# EAGLE design en76-vco4 (EAGLE 6.6.0)
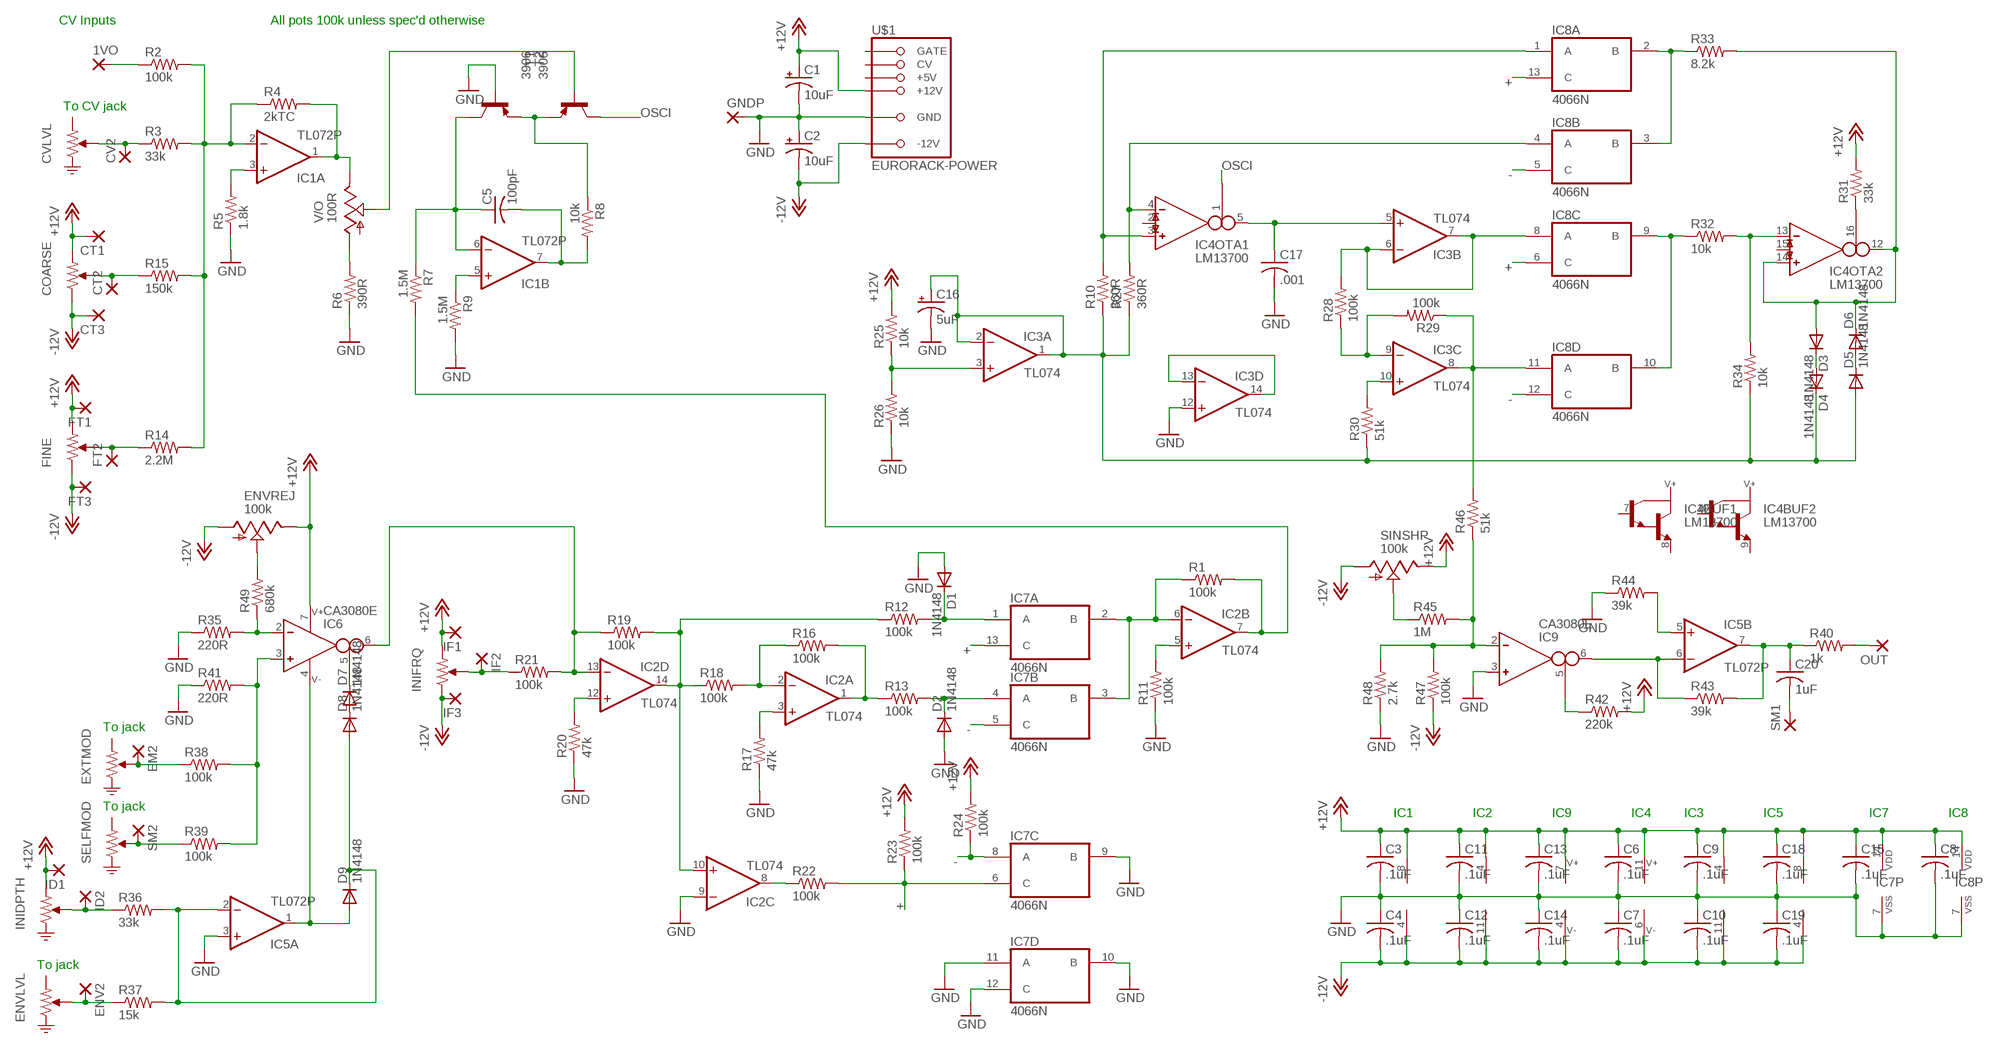
[diagram p0: schematic, sheet 1]

## Parts
1VO  2,54/1,0  [2,54/1,0]
C1  10uF  CPOL-USE2-5  [E2-5]
C2  10uF  CPOL-USE2-5  [E2-5]
C3  .1uF  C-US050-025X075  [C050-025X075]
C4  .1uF  C-US050-025X075  [C050-025X075]
C5  100pF  C-US050-025X075  [C050-025X075]
C6  .1uF  C-US050-025X075  [C050-025X075]
C7  .1uF  C-US050-025X075  [C050-025X075]
C8  .1uF  C-US050-025X075  [C050-025X075]
C9  .1uF  C-US050-025X075  [C050-025X075]
C10  .1uF  C-US050-025X075  [C050-025X075]
C11  .1uF  C-US050-025X075  [C050-025X075]
C12  .1uF  C-US050-025X075  [C050-025X075]
C13  .1uF  C-US050-025X075  [C050-025X075]
C14  .1uF  C-US050-025X075  [C050-025X075]
C15  .1uF  C-US050-025X075  [C050-025X075]
C16  5uF  CPOL-USE2-5  [E2-5]
C17  .001  C-US050-025X075  [C050-025X075]
C18  .1uF  C-US050-025X075  [C050-025X075]
C19  .1uF  C-US050-025X075  [C050-025X075]
C20  1uF  C-US050-025X075  [C050-025X075]
COARSE  POT  (no package)
CT1  2,54/1,0  [2,54/1,0]
CT2  2,54/1,0  [2,54/1,0]
CT3  2,54/1,0  [2,54/1,0]
CV2  2,54/1,0  [2,54/1,0]
CVLVL  POT-ATTEN  (no package)
D1  1N4148  1N4148DO35-7  [DO35-7]
D2  1N4148  1N4148DO35-7  [DO35-7]
D3  1N4148  1N4148DO35-7  [DO35-7]
D4  1N4148  1N4148DO35-7  [DO35-7]
D5  1N4148  1N4148DO35-7  [DO35-7]
D6  1N4148  1N4148DO35-7  [DO35-7]
D7  1N4148  1N4148DO35-7  [DO35-7]
D8  1N4148  1N4148DO35-7  [DO35-7]
D9  1N4148  1N4148DO35-7  [DO35-7]
EM2  2,54/1,0  [2,54/1,0]
ENV2  2,54/1,0  [2,54/1,0]
ENVLVL  POT-ATTEN  (no package)
ENVREJ  100k  TRIM_US-RJ9W  [RJ9W]
EXTMOD  POT-ATTEN  (no package)
FINE  POT  (no package)
FT1  2,54/1,0  [2,54/1,0]
FT2  2,54/1,0  [2,54/1,0]
FT3  2,54/1,0  [2,54/1,0]
GNDP  2,54/1,0  [2,54/1,0]
IC1  TL072P  [DIL08]
IC2  TL074  TL074-TOPP  [DIL14]
IC3  TL074  TL074-TOPP  [DIL14]
IC4  LM13700  LM13700-TOPDIP16  [DIL16]
IC5  TL072P  [DIL08]
IC6  CA3080E  [DIL08]
IC7  4066N  [DIL14]
IC8  4066N  [DIL14]
IC9  CA3080E  [DIL08]
ID1  2,54/1,0  [2,54/1,0]
ID2  2,54/1,0  [2,54/1,0]
IF1  2,54/1,0  [2,54/1,0]
IF2  2,54/1,0  [2,54/1,0]
IF3  2,54/1,0  [2,54/1,0]
INIDPTH  POT-ATTEN  (no package)
INIFRQ  POT  (no package)
OUT  2,54/1,0  [2,54/1,0]
R1  100k  R-US_0207/10  [0207/10]
R2  100k  R-US_0207/10  [0207/10]
R3  33k  R-US_0207/10  [0207/10]
R4  2kTC  R-US_0207/10  [0207/10]
R5  1.8k  R-US_0207/10  [0207/10]
R6  390R  R-US_0207/10  [0207/10]
R7  1.5M  R-US_0207/10  [0207/10]
R8  10k  R-US_0207/10  [0207/10]
R9  1.5M  R-US_0207/10  [0207/10]
R10  360R  R-US_0207/10  [0207/10]
R11  100k  R-US_0207/10  [0207/10]
R12  100k  R-US_0207/10  [0207/10]
R13  100k  R-US_0207/10  [0207/10]
R14  2.2M  R-US_0207/10  [0207/10]
R15  150k  R-US_0207/10  [0207/10]
R16  100k  R-US_0207/10  [0207/10]
R17  47k  R-US_0207/10  [0207/10]
R18  100k  R-US_0207/10  [0207/10]
R19  100k  R-US_0207/10  [0207/10]
R20  47k  R-US_0207/10  [0207/10]
R21  100k  R-US_0207/10  [0207/10]
R22  100k  R-US_0207/10  [0207/10]
R23  100k  R-US_0207/10  [0207/10]
R24  100k  R-US_0207/10  [0207/10]
R25  10k  R-US_0207/10  [0207/10]
R26  10k  R-US_0207/10  [0207/10]
R27  360R  R-US_0207/10  [0207/10]
R28  100k  R-US_0207/10  [0207/10]
R29  100k  R-US_0207/10  [0207/10]
R30  51k  R-US_0207/10  [0207/10]
R31  33k  R-US_0207/10  [0207/10]
R32  10k  R-US_0207/10  [0207/10]
R33  8.2k  R-US_0207/10  [0207/10]
R34  10k  R-US_0207/10  [0207/10]
R35  220R  R-US_0207/10  [0207/10]
R36  33k  R-US_0207/10  [0207/10]
R37  15k  R-US_0207/10  [0207/10]
R38  100k  R-US_0207/10  [0207/10]
R39  100k  R-US_0207/10  [0207/10]
R40  1k  R-US_0207/10  [0207/10]
R41  220R  R-US_0207/10  [0207/10]
R42  220k  R-US_0207/10  [0207/10]
R43  39k  R-US_0207/10  [0207/10]
R44  39k  R-US_0207/10  [0207/10]
R45  1M  R-US_0207/10  [0207/10]
R46  51k  R-US_0207/10  [0207/10]
R47  100k  R-US_0207/10  [0207/10]
R48  2.7k  R-US_0207/10  [0207/10]
R49  680k  R-US_0207/10  [0207/10]
SELFMOD  POT-ATTEN  (no package)
SINSHP  100k  TRIM_US-RJ9W  [RJ9W]
SM1  2,54/1,0  [2,54/1,0]
SM2  2,54/1,0  [2,54/1,0]
T1  3906  2N3906-PNP-TO92-EBC  [TO92-EBC]
T2  3906  2N3906-PNP-TO92-EBC  [TO92-EBC]
U$1  EURORACK-POWER  [PINSHRD_PTH_2X8]
V/O  100R  TRIM_US-RJ9W  [RJ9W]

## Nets
+: IC7.6(C:C) IC7.13(A:C) IC8.6(C:C) IC8.13(A:C) R22.2 R23.1
+12V: C1.+ C3.1 C6.1 C8.1 C9.1 C11.1 C13.1 C15.1 C18.1 COARSE.1 CT1.1(P) ENVREJ.E FINE.1 FT1.1(P) IC1.8(P:V+) IC2.4(P:V+) IC3.4(P:V+) IC4.11 IC5.8(P:V+) IC6.7 IC7.14(P:VDD) IC8.14(P:VDD) IC9.7 ID1.1(P) IF1.1(P) INIDPTH.1 INIFRQ.1 R23.2 R24.2 R25.2 R31.2 R42.2 SINSHP.E U$1.+12V@1(+12V) U$1.+12V@2(+12V)
-: IC7.5(B:C) IC7.8(C:A) IC8.5(B:C) IC8.12(D:C) R24.1
-12V: C2.- C4.2 C7.2 C10.2 C12.2 C14.2 C19.2 COARSE.3 CT3.1(P) ENVREJ.A FINE.3 FT3.1(P) IC1.4(P:V-) IC2.11(P:V-) IC3.11(P:V-) IC4.6 IC5.4(P:V-) IC9.4 IF3.1(P) INIFRQ.3 R47.1 SINSHP.A U$1.-12V@1(-12V) U$1.-12V@2(-12V)
GND: C1.- C2.+ C3.2 C4.1 C6.2 C7.1 C8.2 C9.2 C10.1 C11.2 C12.1 C13.2 C14.1 C15.2 C16.- C17.2 C18.2 C19.1 D1.A D2.A GNDP.1(P) IC2.9(C:-IN) IC3.12(D:+IN) IC5.3(A:+IN) IC7.7(P:VSS) IC7.9(C:B) IC7.10(D:B) IC7.11(D:A) IC7.12(D:C) IC8.7(P:VSS) IC9.3(IN_P) R5.1 R6.1 R9.2 R11.1 R17.1 R20.1 R26.1 R35.1 R41.1 R44.1 R48.1 T2.B U$1.GND@1(GND) U$1.GND@2(GND) U$1.GND@3(GND) U$1.GND@4(GND) U$1.GND@5(GND) U$1.GND@6(GND)
N$1: COARSE.2 CT2.1(P) R15.1
N$2: CV2.1(P) CVLVL.2 R3.1
N$3: 1VO.1(P) R2.1
N$4: T1.B V/O.S
N$5: IC1.3(A:+IN) R5.2
N$6: IC1.2(A:-IN) R2.2 R3.2 R4.1 R14.2 R15.2
N$7: IC1.1(A:OUT) R4.2 V/O.E
N$8: R6.2 V/O.A
N$9: C5.1 IC1.6(B:-IN) R7.1 T2.C
N$10: R8.1 T1.E T2.E
N$11: C5.2 IC1.7(B:OUT) R8.2
N$12: FINE.2 FT2.1(P) R14.1
N$13: IC4.3(OTA1:IN_P) IC8.1(A:A) R10.2
N$14: IC1.5(B:+IN) R9.1
N$15: IC2.6(B:-IN) IC7.2(A:B) IC7.3(B:B) R1.1
N$16: IC2.5(B:+IN) R11.2
N$17: D1.C IC7.1(A:A) R12.2
N$18: IC2.10(C:+IN) IC2.14(D:OUT) R12.1 R18.1 R19.2
N$19: D2.C IC7.4(B:A) R13.2
N$20: IC2.1(A:OUT) R13.1 R16.2
N$21: IC2.3(A:+IN) R17.2
N$22: ENVREJ.S R49.2
N$23: IC2.13(D:-IN) IC6.6(OUT) R19.1 R21.2
N$24: IC2.12(D:+IN) R20.2
N$25: IC2.2(A:-IN) R16.1 R18.2
N$26: IC3.8(C:OUT) IC8.11(D:A) R29.1 R46.2
N$27: IF2.1(P) INIFRQ.2 R21.1
N$28: IC3.3(A:+IN) R25.1 R26.2
N$29: IC2.8(C:OUT) R22.1
N$30: C16.+ D4.C D5.A IC3.1(A:OUT) IC3.2(A:-IN) R10.1 R27.1 R30.1 R34.1
N$31: IC4.4(OTA1:IN_N) IC8.4(B:A) R27.2
N$32: IC8.9(C:B) IC8.10(D:B) R32.1
N$33: C17.1 IC3.5(B:+IN) IC4.5(OTA1:OUT)
N$34: IC3.6(B:-IN) IC3.7(B:OUT) IC8.8(C:A) R28.2
N$35: IC3.9(C:-IN) R28.1 R29.2
N$36: IC8.2(A:B) IC8.3(B:B) R33.1
N$37: IC3.10(C:+IN) R30.2
N$38: IC4.16(OTA2:I_BIAS) R31.1
N$39: IC4.13(OTA2:IN_N) R32.2 R34.2
N$40: D3.A D6.C IC4.12(OTA2:OUT) IC4.14(OTA2:IN_P) R33.2
N$41: IC6.2(IN_N) R35.2 R49.1
N$42: D3.C D4.A
N$43: D5.C D6.A
N$44: IC3.13(D:-IN) IC3.14(D:OUT)
N$45: D9.A IC5.1(A:OUT) IC6.4
N$46: D7.C IC6.5(I_BIAS)
N$47: D7.A D8.C
N$48: ID2.1(P) INIDPTH.2 R36.1
N$49: D8.A D9.C IC5.2(A:-IN) R36.2 R37.2
N$50: ENV2.1(P) ENVLVL.2 R37.1
N$51: EM2.1(P) EXTMOD.2 R38.1
N$52: R39.1 SELFMOD.2 SM2.1(P)
N$53: C20.1 IC5.7(B:OUT) R40.1 R43.2
N$54: C20.2 SM1.1(P)
N$55: OUT.1(P) R40.2
N$56: IC6.3(IN_P) R38.2 R39.2 R41.2
N$57: IC5.6(B:-IN) IC9.6(OUT) R43.1
N$58: IC9.5(I_BIAS) R42.1
N$59: IC5.5(B:+IN) R44.2
N$60: IC9.2(IN_N) R45.2 R46.1 R47.2 R48.2
N$61: R45.1 SINSHP.S
N$62: IC2.7(B:OUT) R1.2 R7.2
OSCI: IC4.1(OTA1:I_BIAS) T1.C
Unconnected: CVLVL.1 ENVLVL.1 EXTMOD.1 IC4.2(OTA1:I_DIODE) IC4.7(BUF1:B) IC4.8(BUF1:E) IC4.9(BUF2:E) IC4.10(BUF2:B) IC4.15(OTA2:I_DIODE) SELFMOD.1 U$1.+5V@1(+5V) U$1.+5V@2(+5V) U$1.CV@1(CV) U$1.CV@2(CV) U$1.GATE@1(GATE) U$1.GATE@2(GATE)

## Notes on the sheet
- CV Inputs | All pots 100k unless spec'd otherwise
- To CV jack
- To jack
- To jack
- IC1 | IC2 | IC9 | IC4 | IC3 | IC5 | IC7 | IC8
- To jack

## Library data of the parts
1VO CT1-CT3 CV2 EM2 ENV2 FT1-FT3 GNDP ID1 ID2 IF1-IF3 OUT SM1 SM2 = wirepad:2,54/1,0: THROUGH-HOLE PAD
C1 C2 C16 = rcl:CPOL-US: POLARIZED CAPACITOR, American symbol
C3-C15 C17-C20 = rcl:C-US: CAPACITOR, American symbol
COARSE FINE INIFRQ = mmoretti:POT
CVLVL ENVLVL EXTMOD INIDPTH SELFMOD = mmoretti:POT-ATTEN
D1-D9 = diode:1N4148: DIODE high speed (Philips)
ENVREJ SINSHP V/O = pot:TRIM_US-: POTENTIOMETER
IC1 IC5 = mmoretti:TL072: OP AMP
IC2 IC3 = mmoretti:TL074-TOP: OP AMP
IC4 = mmoretti:LM13700-TOP
IC6 IC9 = mmoretti:CA3080: OTA
IC7 IC8 = 40xx:4066: Quad bilateral ANALOG SWITCH
R1-R49 = rcl:R-US_: RESISTOR, American symbol
T1 T2 = transistor-neu-to92:*-PNP-: PNP Transistror
U$1 = mmoretti:EURORACK-POWER

## Board
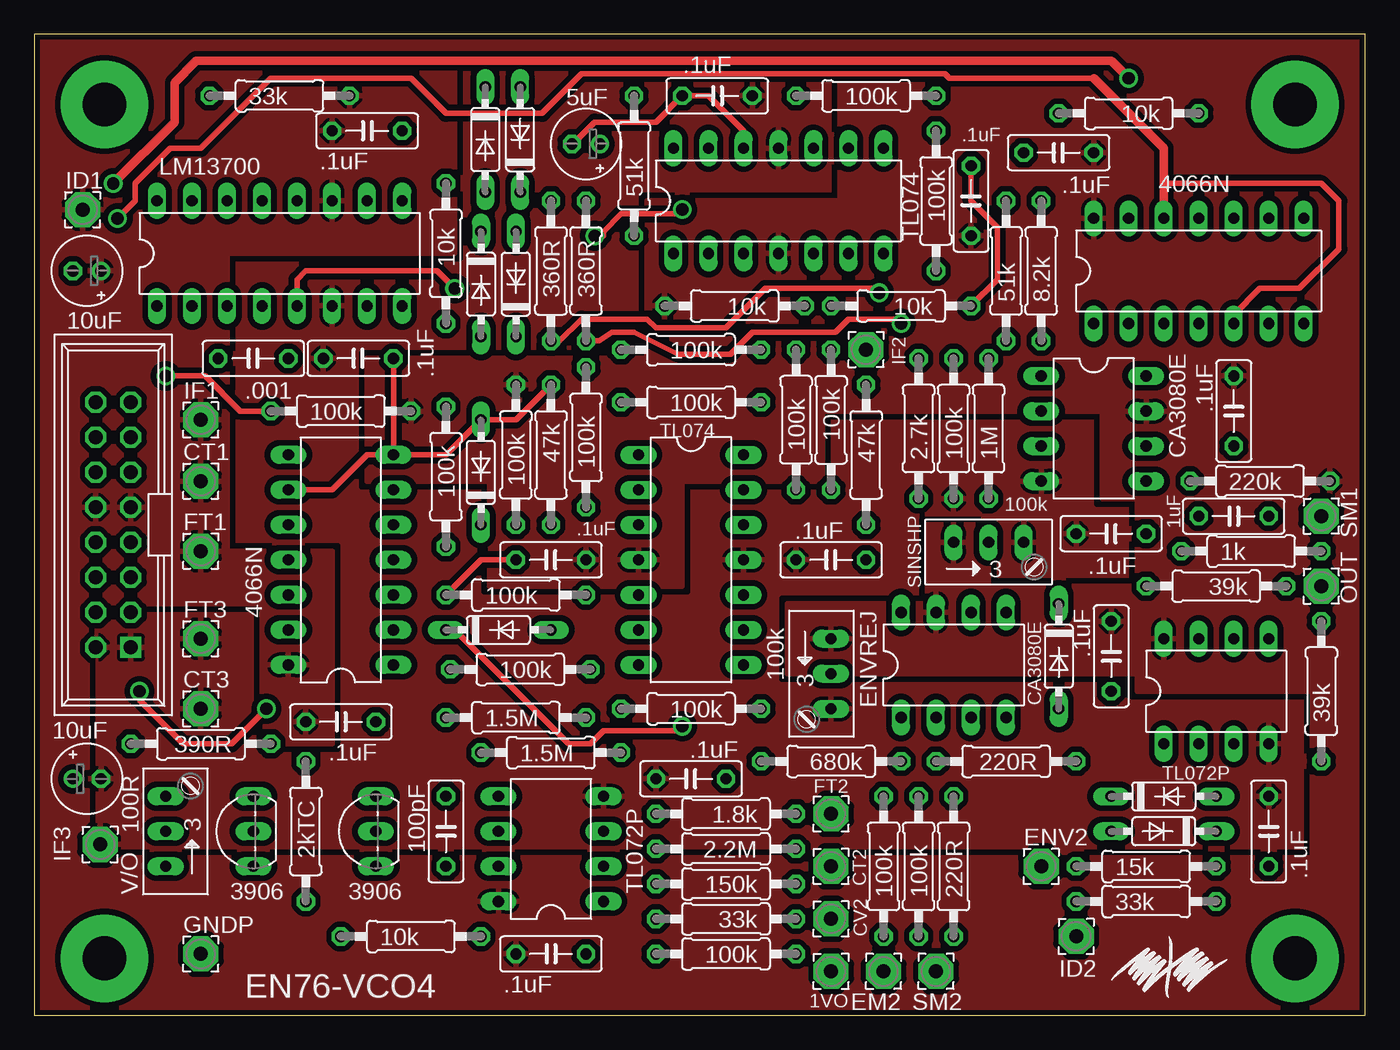
[diagram p1: board, top side]
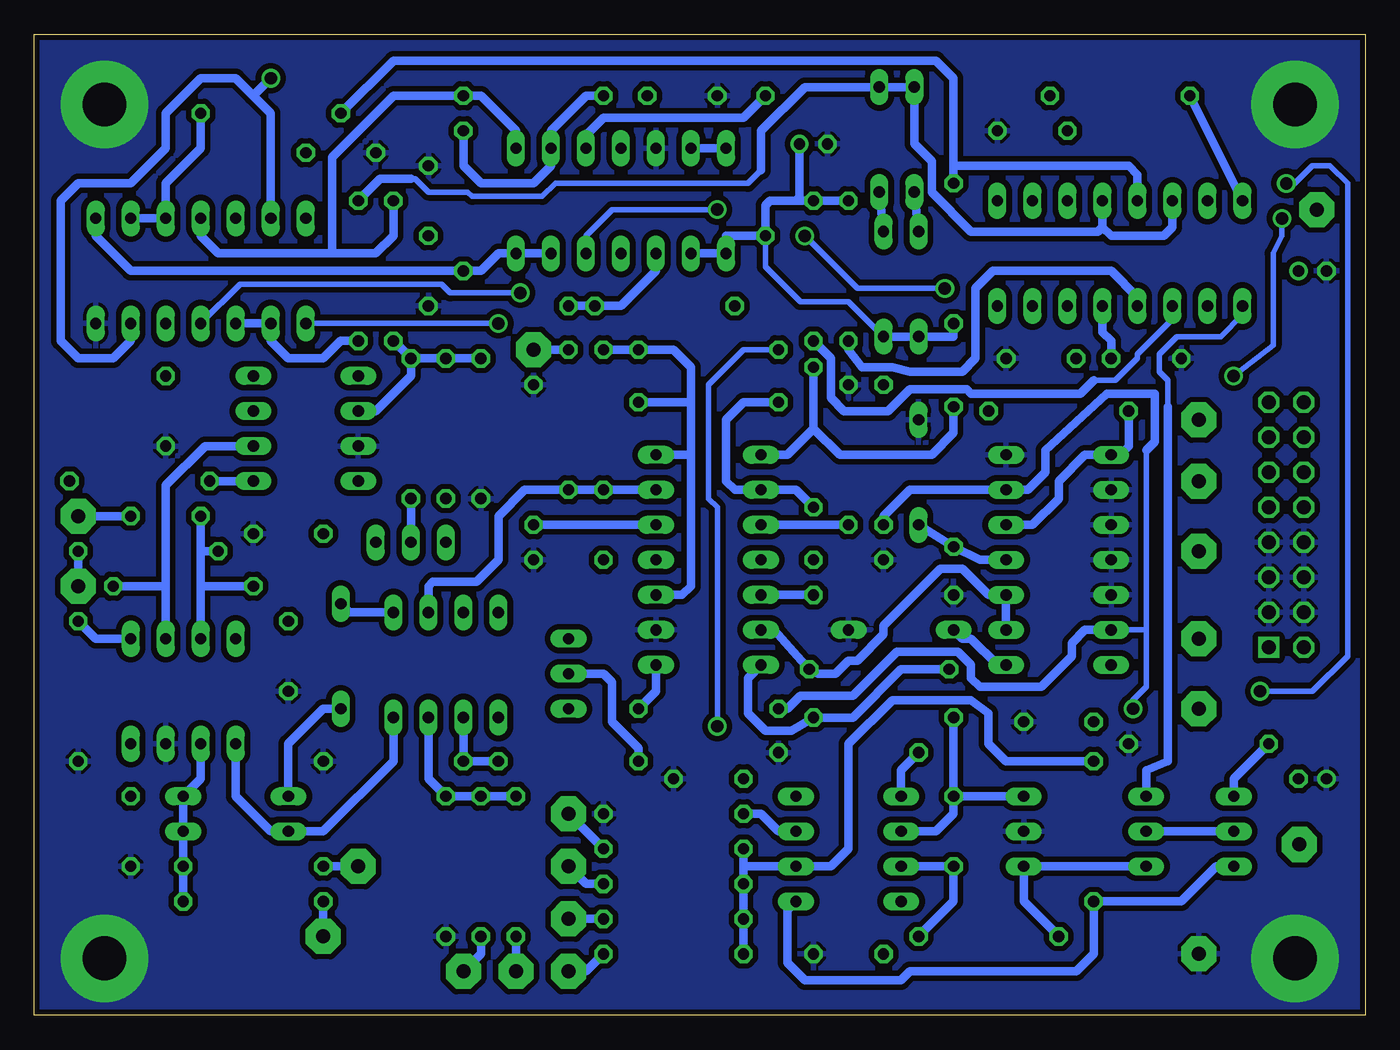
[diagram p2: board, bottom side, seen from below]

Size 96.52 x 71.12 mm. Coordinates in mm from the lower left corner, seen from the top.
Outline: 0,0 96.52,0 96.52,71.12 0,71.12 0,0
Copper layers (1*16): Top 0.035mm / dielectric 1.5mm / Bottom 0.035mm
Design rules "SeeedStudio_2layer_DRU_no_angle_20140221": minimum track width 6mil, minimum drill 12mil, track to track 6mil, track to pad 6mil, pad to pad 6mil, via to via 6mil, smd to smd 0mil, copper to edge 10mil, drill to drill 10mil, minimum pad ring 10mil, minimum via ring 6mil, stop-mask expansion 2mil, vias tented up to drill 100mil, thermal gap 10mil

### Footprints (pad centres in the part's own frame; a part is rotated, then mirrored left to right if it is on the bottom)
2,54/1,0 = drill 1.016 pad 2.54 octagon: 1 0,0
E2-5 = drill 0.813 pad 1.27: + -1.016,0 | drill 0.813 pad 1.27 octagon: - 1.016,0
C050-025X075 = drill 0.813 octagon: 1 -2.54,0; 2 2.54,0
DO35-7 = drill 0.813 long: A 3.81,0; C -3.81,0
RJ9W = drill 0.813 long: A 2.54,0.635; E -2.54,0.635; S 0,0.635
DIL08 = drill 0.813 long: 1 -3.81,-3.81; 2 -1.27,-3.81; 3 1.27,-3.81; 4 3.81,-3.81; 5 3.81,3.81; 6 1.27,3.81; 7 -1.27,3.81; 8 -3.81,3.81
DIL14 = drill 0.813 long: 1 -7.62,-3.81; 2 -5.08,-3.81; 3 -2.54,-3.81; 4 0,-3.81; 5 2.54,-3.81; 6 5.08,-3.81; 7 7.62,-3.81; 8 7.62,3.81; 9 5.08,3.81; 10 2.54,3.81; 11 0,3.81; 12 -2.54,3.81; 13 -5.08,3.81; 14 -7.62,3.81
DIL16 = drill 0.813 long: 1 -8.89,-3.81; 2 -6.35,-3.81; 3 -3.81,-3.81; 4 -1.27,-3.81; 5 1.27,-3.81; 6 3.81,-3.81; 7 6.35,-3.81; 8 8.89,-3.81; 9 8.89,3.81; 10 6.35,3.81; 11 3.81,3.81; 12 1.27,3.81; 13 -1.27,3.81; 14 -3.81,3.81; 15 -6.35,3.81; 16 -8.89,3.81
0207/10 = drill 0.813 octagon: 1 -5.08,0; 2 5.08,0
TO92-EBC = drill 0.813 long: B 0,-1.27; C 2.54,-1.27; E -2.54,-1.27
PINSHRD_PTH_2X8 = drill 1.016 octagon: +5V@1 3.81,1.27; +5V@2 3.81,-1.27; +12V@1 1.27,1.27; +12V@2 1.27,-1.27; -12V@1 -8.89,1.27; CV@1 6.35,1.27; CV@2 6.35,-1.27; GATE@1 8.89,1.27; GATE@2 8.89,-1.27; GND@1 -6.35,1.27; GND@2 -6.35,-1.27; GND@3 -3.81,1.27; GND@4 -3.81,-1.27; GND@5 -1.27,1.27; GND@6 -1.27,-1.27 | drill 1.016 square: -12V@2 -8.89,-1.27

### Placement (x,y rotation side)
1VO  57.78,3.17 0 top
C1  3.81,53.98 180 top
C2  3.81,17.14 0 top
C3  37.47,4.45 0 top
C4  47.62,17.14 180 top
C5  29.84,13.34 270 top
C6  24.13,64.14 0 top
C7  23.5,47.62 180 top
C8  74.3,62.55 180 top
C9  67.94,59.05 90 top
C10  49.53,66.67 0 top
C11  37.47,33.02 180 top
C12  57.78,33.02 180 top
C13  87,43.81 270 top
C14  78.11,34.92 180 top
C15  22.23,21.27 0 top
C16  40.01,63.18 180 top
C17  15.88,47.62 180 top
C18  78.11,26.04 270 top
C19  89.53,13.34 90 top
C20  87,36.2 0 top
CT1  12.06,38.73 0 top
CT2  57.78,10.79 0 top
CT3  12.06,22.23 0 top
CV2  57.78,6.99 0 top
D1  33.66,27.94 0 top
D2  32.38,39.37 90 top
D3  35.24,63.5 90 top
D4  34.92,53.02 90 top
D5  32.38,53.02 270 top
D6  32.7,63.5 270 top
D7  74.3,26.04 270 top
D8  81.92,15.88 0 top
D9  81.92,13.34 180 top
EM2  61.59,3.17 180 top
ENV2  73.03,10.79 0 top
ENVREJ  57.15,24.77 270 top
FT1  12.06,33.66 0 top
FT2  57.78,14.61 0 top
FT3  12.06,27.3 0 top
GNDP  12.06,4.45 0 top
IC1  37.47,12.06 90 top
IC2  47.62,33.02 270 top
IC3  53.98,59.05 0 top
IC4  17.78,55.24 0 top
IC5  85.72,23.5 0 top
IC6  66.67,25.4 0 top
IC7  22.23,33.02 90 top
IC8  84.45,53.98 0 top
IC9  76.83,42.55 270 top
ID1  3.49,58.42 0 top
ID2  75.56,5.71 0 top
IF1  12.06,43.18 0 top
IF2  60.33,48.26 180 top
IF3  4.76,12.38 0 top
OUT  93.34,31.11 90 top
R1  35.24,25.08 180 top
R2  50.16,4.45 180 top
R3  50.16,6.99 180 top
R4  19.68,13.34 270 top
R5  50.16,14.61 180 top
R6  12.06,19.68 180 top
R7  34.92,21.59 0 top
R8  27.3,5.71 0 top
R9  37.47,19.05 0 top
R10  40.01,53.98 270 top
R11  34.92,30.48 0 top
R12  47.62,48.26 180 top
R13  29.84,39.05 270 top
R14  50.16,12.06 180 top
R15  50.16,9.53 180 top
R16  40.01,41.91 90 top
R17  37.47,40.64 270 top
R18  47.62,44.45 180 top
R19  55.24,43.18 90 top
R20  60.33,40.64 270 top
R21  57.78,43.18 270 top
R22  47.62,22.23 180 top
R23  34.92,40.64 90 top
R24  22.23,43.81 0 top
R25  50.8,51.44 180 top
R26  62.87,51.44 180 top
R27  37.47,53.98 270 top
R28  65.41,59.05 270 top
R29  60.33,66.67 180 top
R30  43.5,61.59 90 top
R31  17.78,66.67 0 top
R32  79.38,65.41 180 top
R33  73.03,53.98 90 top
R34  29.84,55.24 90 top
R35  70.48,18.41 180 top
R36  80.64,8.26 0 top
R37  80.64,10.79 0 top
R38  61.59,10.79 90 top
R39  64.14,10.79 90 top
R40  88.27,33.66 0 top
R41  66.67,10.79 90 top
R42  88.9,38.73 0 top
R43  85.72,31.11 180 top
R44  93.34,23.5 90 top
R45  69.22,42.55 90 top
R46  70.48,53.98 90 top
R47  66.67,42.55 90 top
R48  64.14,42.55 90 top
R49  57.78,18.41 180 top
SINSHP  69.22,33.66 0 top
SM1  93.34,36.2 90 top
SM2  65.41,3.17 180 top
T1  14.61,13.34 90 top
T2  23.5,13.34 90 top
U$1  5.71,35.56 90 top
V/O  10.16,13.34 90 top

### Tracks (layer width: path | path; a pad name or v marks a point on that pad's centre or on a via)
+  (via drill 0.9)
  Top 0.406: v7.62,23.5 7.62,22.86 10.79,19.68 14.29,19.68 v16.83,22.23
  Top 0.61: v79.38,67.94 78.11,69.22 11.75,69.22 10.16,67.63 10.16,64.77 v5.71,60.33
  Bottom 0.406: v5.71,60.33 5.08,60.33 3.81,61.59 2.54,61.59 1.27,60.33 1.27,26.04 3.81,23.5 v7.62,23.5 | v16.83,22.23 16.83,22.86 15.88,23.81 15.88,27.94 | 15.88,40.96 15.88,27.94 | 17.78,27.94 15.88,27.94
  Bottom 0.61: 17.78,27.94 IC7.13 20.32,27.94 21.27,26.99 21.27,26.04 23.5,23.81 27.94,23.81 28.57,24.45 28.57,25.4 29.53,26.35 33.97,26.35 37.15,23.18 40.96,23.18 41.91,22.23 R22.2 | 15.88,40.96 15.24,41.59 15.24,45.09 18.73,45.09 23.18,40.96 23.18,39.37 24.45,38.1 IC7.6 33.02,38.1 34.92,36.2 R23.1 | IC8.6 89.53,48.9 90.81,47.62 93.34,47.62 94.61,48.9 94.61,59.05 93.34,60.33 89.53,60.33 87,62.87 87,65.41 84.45,67.94 81.92,67.94 80.64,66.67 | 80.64,66.67 79.38,65.41 IC8.13 | 80.64,66.67 v79.38,67.94
+12V
  pour Top (isolate 0.406): 0,0 96.52,0 96.52,11.43 0,11.43
  pour Top (isolate 0.406): 96.52,11.43 96.52,71.12 58.42,71.12 58.42,59.05 44.45,59.05 44.45,47.62 24.13,47.62 24.13,38.73 33.02,38.73 33.02,31.11 46.99,31.11 46.99,38.73 57.15,38.73 57.15,43.81 77.47,43.81 77.47,37.47 92.71,37.47 92.71,11.43
  pour Top (isolate 0.406): 92.71,23.5 80.01,23.5 80.01,24.77 54.61,24.77 54.61,29.84 64.77,29.84 64.77,35.56 69.22,35.56 69.22,31.11 80.01,31.11 80.01,37.47 92.71,37.47
  pour Top (isolate 0.406): 0,71.12 30.48,71.12 30.48,55.24 13.97,55.24 13.97,33.66 21.59,33.66 21.59,19.68 16.51,19.68 16.51,29.84 0,29.84
  pour Top (isolate 0.406): 0,38.1 3.81,38.1 3.81,11.43 0,11.43
  pour Top (isolate 0.406): 0,71.12 59.69,71.12 59.69,68.58 0,68.58
-  (via drill 0.9)
  Top 0.406: 76.83,67.94 66.36,67.94 66.04,68.26 39.69,68.26 36.83,65.41 29.84,65.41 27.3,67.94 17.14,67.94 12.06,62.87 9.84,62.87 7.3,60.33 7.3,59.05 v6.03,57.78 | v9.53,46.35 12.38,46.35 14.92,43.81 R24.1 | IC8.5 87,50.8 88.9,52.7 91.76,52.7 94.61,55.56 94.61,59.05 93.34,60.33 81.92,60.33
  Top 0.61: IC8.12 81.92,60.33 81.92,62.87 76.83,67.94
  Bottom 0.406: v6.03,57.78 6.03,56.52 6.67,55.24 6.67,48.58 v9.53,46.35
  Bottom 0.61: IC7.5 24.13,35.56 22.23,37.47 22.23,38.73 20.32,40.64 IC7.8 17.78,40.64 17.14,41.27 R24.1
-12V
  pour Top (isolate 0.406, rank 2): 3.81,29.84 16.51,29.84 16.51,19.68 21.59,19.68 21.59,33.66 13.97,33.66 13.97,55.24 30.48,55.24 30.48,68.26 58.42,68.26 58.42,59.05 44.45,59.05 44.45,47.62 24.13,47.62 24.13,38.73 33.02,38.73 33.02,31.11 46.99,31.11 46.99,38.73 57.15,38.73 57.15,43.81 77.47,43.81 77.47,37.47 80.01,37.47 80.01,31.11 69.22,31.11 69.22,35.56 64.77,35.56 64.77,29.84 54.61,29.84 54.61,24.77 80.01,24.77 80.01,23.5 92.71,23.5 92.71,11.43 3.81,11.43
GND  (via drill 3.17 pad 6.35)
  Top 0.406: IC7.9 21.59,38.1 24.13,40.64 IC7.7 | IC7.7 C7.1 | IC7.7 29.84,40.64 D2.A 34.92,43.18 R17.1 | C16.- 39.05,63.18 40.64,64.77 45.09,64.77 C10.1 48.9,66.67 51.44,64.14 IC3.12 | C11.2 32.38,33.02 R11.1 | R26.1 69.85,53.34 69.85,57.15 67.94,59.05 C9.2
  other vias: 5.08,66.04 91.44,66.04 91.44,4.13 5.08,4.13
  pour Bottom (isolate 0.406): 0,71.12 96.52,71.12 96.52,0 0,0
N$1
  Bottom 0.61: R15.1 56.52,9.53 CT2.1
N$2
  Bottom 0.61: R3.1 CV2.1
N$3
  Bottom 0.61: 1VO.1 56.52,3.17 R2.1
N$4
  Bottom 0.61: V/O.S T1.B
N$5
  Bottom 0.61: IC1.3 42.55,13.34 43.81,14.61 R5.2
N$6
  Bottom 0.61: R2.2 R3.2 R15.2 45.09,10.79 | 45.09,10.79 R14.2 | 45.09,10.79 IC1.2 38.73,10.79 37.47,12.06 37.47,19.68 34.29,22.86 28.57,22.86 27.3,21.91 27.3,19.68 26.04,18.41 R4.1
N$7
  Bottom 0.61: V/O.E 10.79,10.79 13.34,8.26 R4.2 19.68,4.45 20.95,3.17 33.02,3.17 33.66,2.54 40.64,2.54 41.91,3.81 41.91,7.62 IC1.1
N$8
  Bottom 0.61: R6.2 9.53,17.14 V/O.A
N$9
  Bottom 0.61: T2.C C5.1 | C5.1 29.84,14.61 31.11,13.34 IC1.6 | R7.1 C5.1
N$10
  Bottom 0.61: T1.E T2.E 24.77,8.26 R8.1
N$11
  Bottom 0.61: IC1.7 C5.2 29.84,8.26 R8.2
N$12
  Bottom 0.61: FT2.1 R14.1
N$13  (via drill 0.9)
  Top 0.406: R10.2 40.96,48.9 41.91,49.53 43.5,49.53 46.67,47.94 50.48,47.94 52.07,49.53 58.1,49.53 59.05,50.48 62.55,50.48 v62.87,50.16
  Bottom 0.406: IC4.3 13.97,50.48 16.51,47.94 16.51,47.62 18.1,46.04 19.68,46.04 | v62.87,50.16 IC8.1
  Bottom 0.61: 19.68,46.04 20.64,45.09 28.57,45.09 28.89,45.4 33.02,45.4 34.61,43.81 37.78,43.81 38.73,44.77 38.73,47.62 R10.2
N$14
  Bottom 0.61: IC1.5 33.66,17.78 R9.1
N$15
  Bottom 0.61: IC7.2 IC7.3 27.3,30.48 29.21,32.38 30.8,32.38 34.92,28.26 34.92,27.62 36.83,25.72 37.47,25.72 38.42,24.77 39.69,24.77 R1.1 42.86,27.94 IC2.6
N$16
  Bottom 0.61: IC2.5 R11.2
N$17  (via drill 0.9)
  Top 0.406: D1.C 30.48,27.94 38.73,19.68 40.32,19.68 41.27,20.64 46.67,20.64 v46.99,20.95
  Bottom 0.406: v46.99,20.95 46.99,36.83 47.62,37.47 47.62,45.72 45.09,48.26 R12.2
  Bottom 0.61: IC7.1 26.67,25.4 28.57,27.3 29.21,27.3 D1.C
N$18
  Bottom 0.61: IC2.10 49.53,30.48 48.9,31.11 48.9,40.64 | 48.9,40.64 48.9,44.45 | 48.9,44.45 48.9,46.99 50.16,48.26 R12.1 R19.2 | IC2.14 48.9,40.64 | R18.1 48.9,44.45
N$19
  Bottom 0.61: IC7.4 27.94,33.02 R13.2 D2.C
N$20
  Bottom 0.61: IC2.1 41.91,40.64 40.01,42.55 | 40.01,42.55 R16.2 | R13.1 29.84,42.23 31.43,40.64 38.1,40.64 40.01,42.55
N$21
  Bottom 0.61: R17.2 IC2.3
N$22
  Bottom 0.61: R49.2 52.7,19.37 54.61,21.27 54.61,24.13 55.24,24.77 ENVREJ.S
N$23
  Bottom 0.61: IC2.13 R19.1 R21.2 60.96,38.1 62.87,36.2 62.87,33.02 64.45,31.43 67.63,31.43 67.94,31.11 IC6.6
N$24
  Bottom 0.61: R20.2 IC2.12
N$25
  Bottom 0.61: R16.1 41.27,38.1 IC2.2 45.72,38.1 46.35,38.73 46.35,43.18 45.09,44.45 R18.2
N$26
  Bottom 0.61: IC3.8 61.59,64.14 64.14,66.67 R29.1 70.48,66.67 74.93,62.23 74.93,55.24 | R46.2 70.48,56.52 71.75,55.24 74.93,55.24 | 74.93,55.24 83.19,55.24 84.45,56.52 IC8.11
N$27
  Bottom 0.61: IF2.1 R21.1
N$28
  Bottom 0.61: IC3.3 51.44,53.98 53.98,51.44 R25.1 R26.2
N$29
  Bottom 0.61: IC2.8 51.44,23.5 R22.1
N$30
  Bottom 0.406: D4.C 37.47,51.75 40.96,51.75 43.5,54.29 R30.1
  Bottom 0.61: D4.C D5.A 29.84,49.21 R34.1 | R27.1 R10.1 41.27,59.05 | IC3.2 IC3.1 46.35,56.52 R30.1 43.5,58.74 43.18,59.05 41.27,59.05 | C16.+ 41.02,59.31 41.27,59.05
N$31  (via drill 0.9)
  Top 0.406: R27.2 38.1,48.9 39.69,50.48 44.45,50.48 45.09,49.85 50.16,49.85 53.02,52.7 60.96,52.7 v61.28,52.39
  Bottom 0.406: v61.28,52.39 66.36,52.39 66.99,53.02 81.6,53.02 IC8.4
  Bottom 0.61: IC4.4 16.51,52.07 18.41,53.98 26.99,53.98 28.26,52.7 28.26,47.62 29.21,46.67 33.02,46.67 34.29,46.99 36.51,46.99 37.47,48.26 R27.2
N$32
  Bottom 0.61: IC8.9 IC8.10 87,60.33 84.45,62.87 R32.1
N$33  (via drill 0.9)
  Top 0.406: IC4.5 19.05,53.34 19.68,53.98 29.21,53.98 v30.48,52.7 | v46.99,58.42 46.67,58.1 42.55,58.1 41.27,56.83 41.27,56.52 v40.64,56.52
  Bottom 0.406: v46.99,58.42 54.61,58.42 56.52,56.52 IC3.5 | v30.48,52.7 36.83,52.7 v40.64,56.52
  Bottom 0.61: C17.1 18.41,48.9 19.05,49.53 IC4.5
N$34
  Bottom 0.61: IC8.8 92.08,56.52 89.53,53.98 R28.2 64.14,53.98 62.87,55.24 IC3.7 IC3.6
N$35
  Bottom 0.61: R29.2 56.52,66.67 59.05,64.14 IC3.9 59.05,61.59 60.33,60.33 64.14,60.33 65.41,61.59 R28.1
N$36
  Bottom 0.61: R33.1 74.3,48.9 75.56,47.62 78.11,47.62 79.38,48.9 IC8.2 IC8.3
N$37
  Bottom 0.61: R30.2 45.09,65.09 55.24,65.09 56.52,63.82 IC3.10
N$38
  Bottom 0.61: R31.1 IC4.16
N$39
  Bottom 0.61: IC4.13 16.51,60.96 17.14,61.59 29.84,61.59 | 29.84,61.59 R34.2 | 29.84,61.59 29.84,67.94 31.11,69.22 70.48,69.22 R32.2
N$40
  Bottom 0.406: 69.22,60.64 68.9,60.64 67.94,59.69 65.09,59.69 64.77,59.37 59.69,59.37 58.74,60.33 44.77,60.33 43.81,61.28
  Bottom 0.61: IC4.14 13.97,57.15 14.61,56.52 18.41,56.52 19.05,57.15 | 19.05,57.15 IC4.12 | 43.81,61.28 43.81,64.14 40.64,67.31 D3.A D6.C 32.7,63.18 31.43,61.91 31.43,59.69 28.57,56.83 19.37,56.83 19.05,57.15 | 69.22,60.64 71.44,60.64 R33.2
N$41
  Bottom 0.61: IC6.2 R35.2 R49.1
N$42
  Bottom 0.61: D3.C D4.A
N$43
  Bottom 0.61: D6.A D5.C
N$44
  Bottom 0.61: IC3.14 IC3.13
N$45
  Bottom 0.61: IC6.4 70.48,18.41 75.56,13.34 D9.A 79.38,13.34 81.92,15.88 IC5.1
N$46
  Bottom 0.61: IC6.5 73.66,29.21 D7.C
N$47
  Bottom 0.61: D7.A 75.56,22.23 78.11,19.68 D8.C
N$48
  Bottom 0.61: R36.1 ID2.1
N$49
  Bottom 0.61: IC5.2 84.45,17.14 D8.A D9.C R37.2 R36.2
N$50
  Bottom 0.61: R37.1 ENV2.1
N$51
  Bottom 0.61: EM2.1 R38.1
N$52
  Bottom 0.61: R39.1 64.14,4.45 SM2.1
N$53
  Bottom 0.61: IC5.7 84.45,31.11 | 84.45,31.11 84.45,33.66 | 84.45,33.66 C20.1 | R40.1 84.45,33.66 | R43.2 84.45,31.11
N$54
  Bottom 0.61: SM1.1 C20.2
N$55
  Bottom 0.61: OUT.1 R40.2
N$56
  Bottom 0.61: IC6.3 67.94,17.14 R41.2 R39.2 R38.2
N$57
  Bottom 0.61: IC5.6 87,31.11 | 87,31.11 87,38.42 84.14,41.27 IC9.6 | R43.1 87,31.11
N$58
  Bottom 0.61: IC9.5 R42.1
N$59
  Bottom 0.61: IC5.5 92.08,27.3 R44.2
N$60
  Bottom 0.61: IC9.2 71.75,43.81 69.22,46.35 R45.2 | R48.2 R47.2 R45.2 | R45.2 R46.1
N$61
  Bottom 0.61: SINSHP.S R45.1
N$62
  Bottom 0.61: IC2.7 44.77,24.45 44.77,21.91 43.5,20.64 41.59,20.64 R7.2 37.15,21.59 33.66,25.08 R1.2
OSCI
  Bottom 0.406: IC4.1 8.89,50.8 10.48,49.21 13.65,49.21 14.92,47.94 14.92,46.67 14.29,46.04 14.29,44.13
  Bottom 0.61: T1.C 15.88,17.78 14.29,18.41 14.29,44.13

### Text on the board
tPlace: EN76-VCO4